# Altium project PCB_Project_Main.PrjPcb
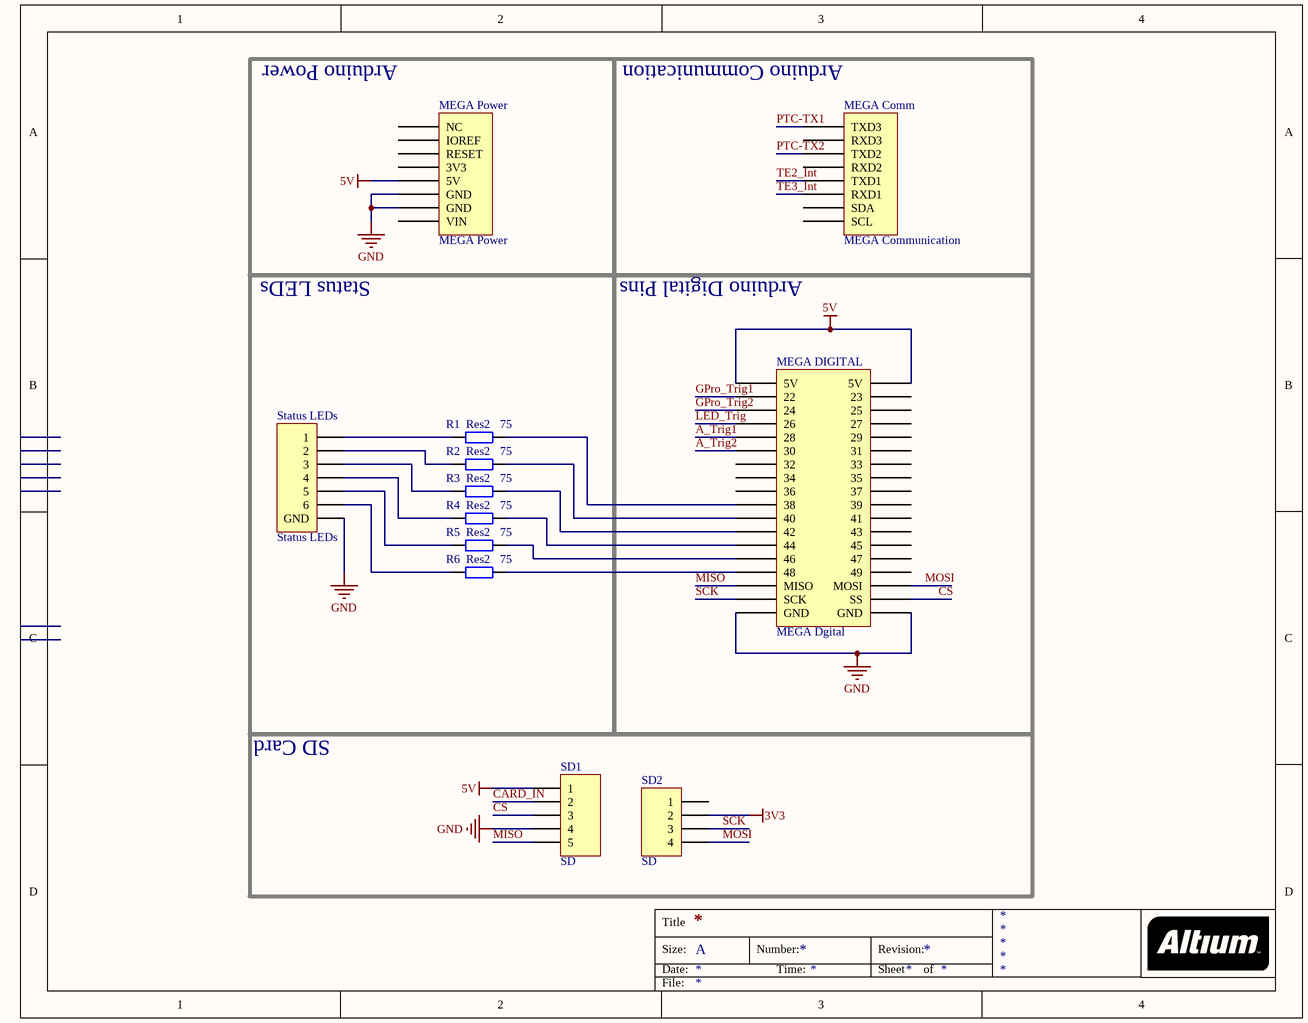
[diagram p0: ArduinoPWR-COMM-DIG_SDCard.SchDoc]
5 sheets, 49 parts. Net scope: global (net labels, ports and power ports of the same name join across sheets).
Board file: ArduinoMainBoard.PcbDoc
Sheets:
  ArduinoPWR-COMM-DIG_SDCard.SchDoc
  Analog_Input.SchDoc
  Telemetry_AnalogSensors_PTC08_Shifter.SchDoc
  Power_TimerEvents.SchDoc
  GoPro_Actuator_LED.SchDoc

## Sheet ArduinoPWR-COMM-DIG_SDCard.SchDoc
size A

### Parts
MEGA_Comm  MEGA Communication  [HDR1X8]
MEGA_DIGITAL  MEGA Dgital  [HDR2X18]
MEGA_Power  MEGA Power  [HDR1X8]
R1  Res2  value 75  [AXIAL-0.4]
R2  Res2  value 75  [AXIAL-0.4]
R3  Res2  value 75  [AXIAL-0.4]
R4  Res2  value 75  [AXIAL-0.4]
R5  Res2  value 75  [AXIAL-0.4]
R6  Res2  value 75  [AXIAL-0.4]
SD1  SD  [HDR1X5]
SD2  SD  [HDR1X4]
Status_LEDs  Status LEDs  [HDR1X7]

### Blocks framed on the sheet
Status LEDs: R1-R6 Status_LEDs
Arduino Digital Pins: MEGA_DIGITAL
SD Card: SD1 SD2

### Nets
3V3: SD2.2
5V: MEGA_DIGITAL.1(5V) MEGA_DIGITAL.2(5V) MEGA_Power.5(5V) SD1.1
GND: MEGA_DIGITAL.35(GND) MEGA_DIGITAL.36(GND) MEGA_Power.6(GND) MEGA_Power.7(GND) SD1.4 Status_LEDs.7(GND)
A_Trig1: MEGA_DIGITAL.9(28)
A_Trig2: MEGA_DIGITAL.11(30)
CARD_IN: SD1.2
CS: MEGA_DIGITAL.34(SS) SD1.3
GPro_Trig1: MEGA_DIGITAL.5(22)
GPro_Trig2: MEGA_DIGITAL.25(24)
LED_Trig: MEGA_DIGITAL.7(26)
MISO: MEGA_DIGITAL.31(MISO) SD1.5
MOSI: MEGA_DIGITAL.32(MOSI) SD2.4
PTC-TX1: MEGA_Comm.1(TXD3)
PTC-TX2: MEGA_Comm.3(TXD2)
SCK: MEGA_DIGITAL.33(SCK) SD2.3
TE2_Int: MEGA_Comm.5(TXD1)
TE3_Int: MEGA_Comm.6(RXD1)
NetMEGA_DIGITAL_3: MEGA_DIGITAL.3(44) R4.1
NetMEGA_DIGITAL_19: MEGA_DIGITAL.19(38) R1.1
NetMEGA_DIGITAL_21: MEGA_DIGITAL.21(40) R2.1
NetMEGA_DIGITAL_23: MEGA_DIGITAL.23(42) R3.1
NetMEGA_DIGITAL_27: MEGA_DIGITAL.27(46) R5.1
NetMEGA_DIGITAL_29: MEGA_DIGITAL.29(48) R6.1
NetR1_2: R1.2 Status_LEDs.1
NetR2_2: R2.2 Status_LEDs.2
NetR3_2: R3.2 Status_LEDs.3
NetR4_2: R4.2 Status_LEDs.4
NetR5_2: R5.2 Status_LEDs.5
NetR6_2: R6.2 Status_LEDs.6

Not connected (* = marked no-connect by the designer): MEGA_Comm 2(RXD3) 4(RXD2) 7(SDA) 8(SCL); MEGA_DIGITAL 4(23) 6(25) 8(27) 10(29) 12(31) 13(32) 14(33) 15(34) 16(35) 17(36) 18(37) 20(39) 22(41) 24(43) 26(45) 28(47) 30(49); MEGA_Power 1(NC) 2(IOREF) 3(RESET) 4(3V3) 8(VIN); SD2 1

### Notes on the sheet
- Arduino Power
- (near MEGA_Comm) Arduino Communication
- Title
- Size:
- Date:
- A
- Number:
- Time:
- Revision:
- Sheet
- of
- File:

### Library data of the parts
MEGA_Comm MEGA_DIGITAL MEGA_Power = Component_1
R1-R6 = Res2: Resistor; Published: 8-Jun-2000; LatestRevisionDate: 17-Jul-2002; LatestRevisionNote: Re-released for DXP Platform.; PackageReference: AXIAL-0.4; Publisher: Altium Limited; PackageDescription: Axial Device, Thru-Hole; 2 Leads; 0.4 in Pin Spacing
SD1 = Header 5: Header, 5-Pin; LatestRevisionDate: 17-Jul-2002; LatestRevisionNote: Re-released for DXP Platform.; Publisher: Altium Limited
SD2 = Header 4: Header, 4-Pin; LatestRevisionDate: 17-Jul-2002; LatestRevisionNote: Re-released for DXP Platform.; Publisher: Altium Limited
Status_LEDs = Header 7: Header, 7-Pin; LatestRevisionDate: 17-Jul-2002; LatestRevisionNote: Re-released for DXP Platform.; Publisher: Altium Limited

## Sheet Analog_Input.SchDoc
size A
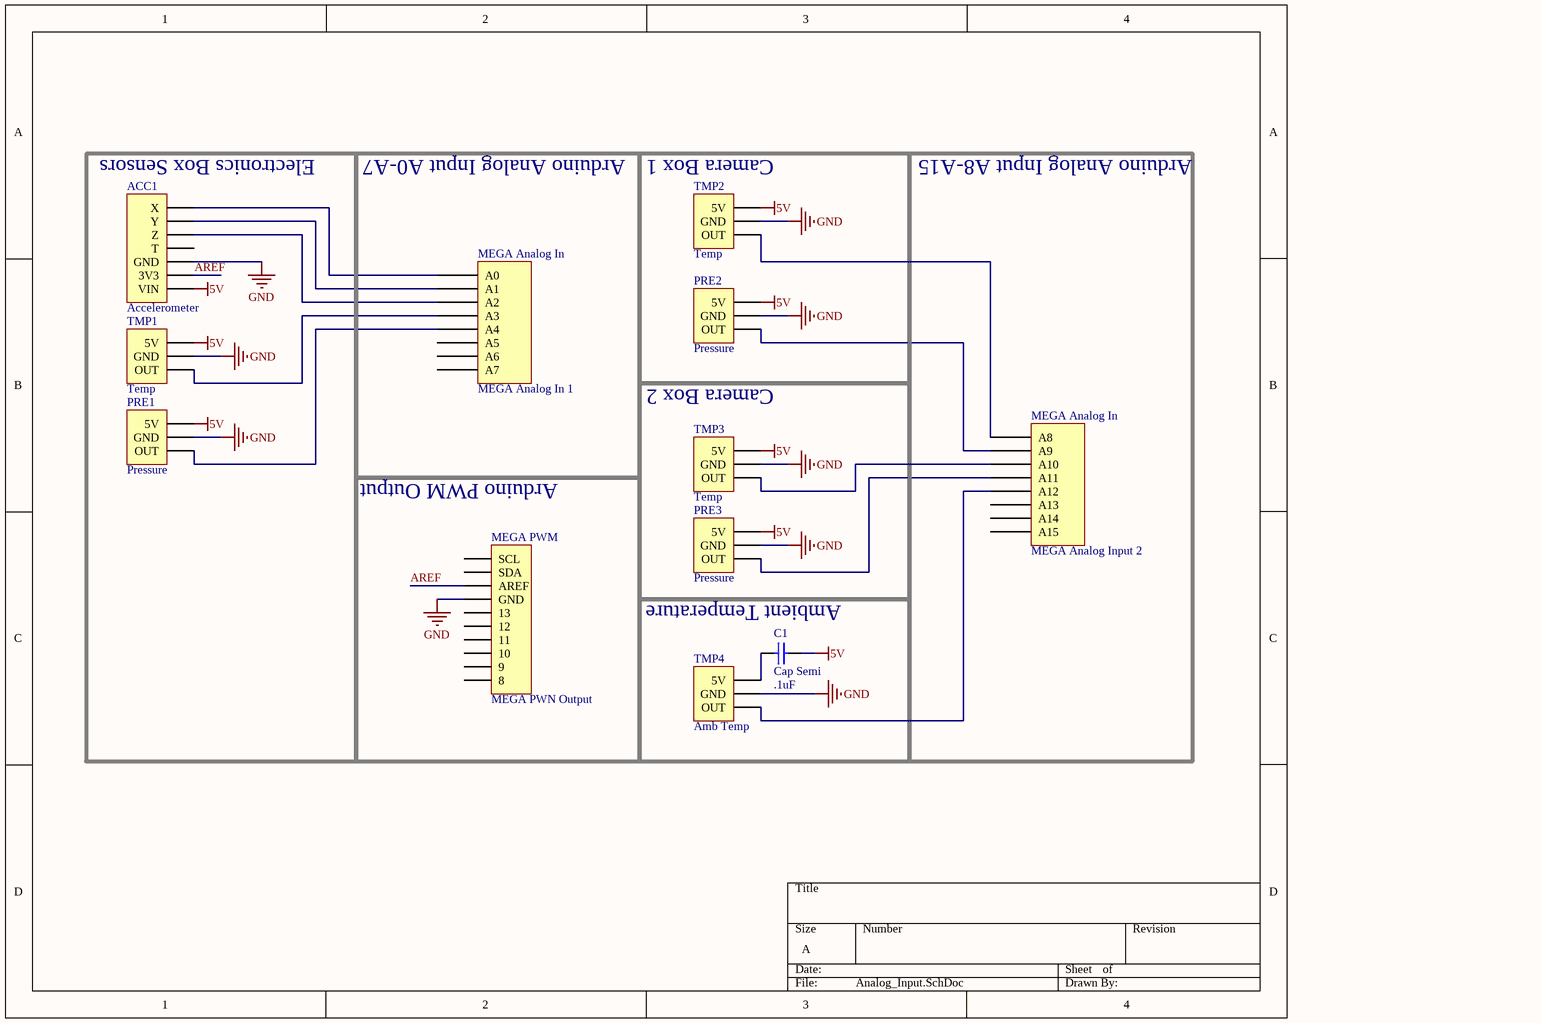
[diagram p1: Analog_Input.SchDoc]

### Parts
(Parts that share a designator on the sheet are numbered #1, #2 ... from top to bottom, then left to right.)
ACC1  Accelerometer  [HDR1X7]
C1  Cap Semi  value .1uF  [0402]
MEGA_Analog_In#1  MEGA Analog In 1  [HDR1X8]
MEGA_Analog_In#2  MEGA Analog Input 2  [HDR1X8]
MEGA_PWM  MEGA PWN Output  [HDR1X10]
PRE1  Pressure  [HDR1X3]
PRE2  Pressure  [HDR1X3]
PRE3  Pressure  [HDR1X3]
TMP1  Temp  [HDR1X3]
TMP2  Temp  [HDR1X3]
TMP3  Temp  [HDR1X3]
TMP4  Amb Temp  [HDR1X3]

### Blocks framed on the sheet
Electronics Box Sensors: ACC1 PRE1 TMP1
Arduino Analog Input A0-A7: MEGA_Analog_In#1
Camera Box 1: PRE2 TMP2
Arduino Analog Input A8-A15: MEGA_Analog_In#2
Camera Box 2: PRE3 TMP3
Arduino PWM Output: MEGA_PWM
Ambient Temperature: C1 TMP4

### Nets
5V: ACC1.1(VIN) C1.1 PRE1.1(5V) PRE2.1(5V) PRE3.1(5V) TMP1.1(5V) TMP2.1(5V) TMP3.1(5V)
GND: ACC1.3(GND) MEGA_PWM.4(GND) PRE1.2(GND) PRE2.2(GND) PRE3.2(GND) TMP1.2(GND) TMP2.2(GND) TMP3.2(GND) TMP4.2(GND)
AREF: ACC1.2(3V3) MEGA_PWM.3(AREF)
NetACC1_5: ACC1.5(Z) MEGA_Analog_In#1.3(A2)
NetACC1_6: ACC1.6(Y) MEGA_Analog_In#1.2(A1)
NetACC1_7: ACC1.7(X) MEGA_Analog_In#1.1(A0)
NetC1_2: C1.2 TMP4.1(5V)
NetMEGA_Analog_In#1_4: MEGA_Analog_In#1.4(A3) TMP1.3(OUT)
NetMEGA_Analog_In#1_5: MEGA_Analog_In#1.5(A4) PRE1.3(OUT)
NetMEGA_Analog_In#2_1: MEGA_Analog_In#2.1(A8) TMP2.3(OUT)
NetMEGA_Analog_In#2_2: MEGA_Analog_In#2.2(A9) PRE2.3(OUT)
NetMEGA_Analog_In#2_3: MEGA_Analog_In#2.3(A10) TMP3.3(OUT)
NetMEGA_Analog_In#2_4: MEGA_Analog_In#2.4(A11) PRE3.3(OUT)
NetMEGA_Analog_In#2_5: MEGA_Analog_In#2.5(A12) TMP4.3(OUT)

Not connected (* = marked no-connect by the designer): ACC1 4(T); MEGA_Analog_In#1 6(A5) 7(A6) 8(A7); MEGA_Analog_In#2 6(A13) 7(A14) 8(A15); MEGA_PWM 1(SCL) 2(SDA) 5(13) 6(12) 7(11) 8(10) 9 10(8)

### Library data of the parts
ACC1 = Header 7: Header, 7-Pin; LatestRevisionDate: 17-Jul-2002; LatestRevisionNote: Re-released for DXP Platform.; Publisher: Altium Limited
C1 = Cap Semi: Capacitor (Semiconductor SIM Model); Published: 8-Jun-2000; LatestRevisionDate: 29-May-2009; LatestRevisionNote: IPC-7351 Footprint Added.; PackageReference: C1206; Publisher: Altium Limited; PackageDescription: Chip Capacitor
MEGA_Analog_In#1 MEGA_Analog_In#2 = Component_1
MEGA_PWM = Header 10: Header, 10-Pin; LatestRevisionDate: 17-Jul-2002; LatestRevisionNote: Re-released for DXP Platform.; Publisher: Altium Limited
PRE1-PRE3 TMP1-TMP4 = Header 3: Header, 3-Pin; LatestRevisionDate: 17-Jul-2002; LatestRevisionNote: Re-released for DXP Platform.; Publisher: Altium Limited

## Sheet Telemetry_AnalogSensors_PTC08_Shifter.SchDoc
size A
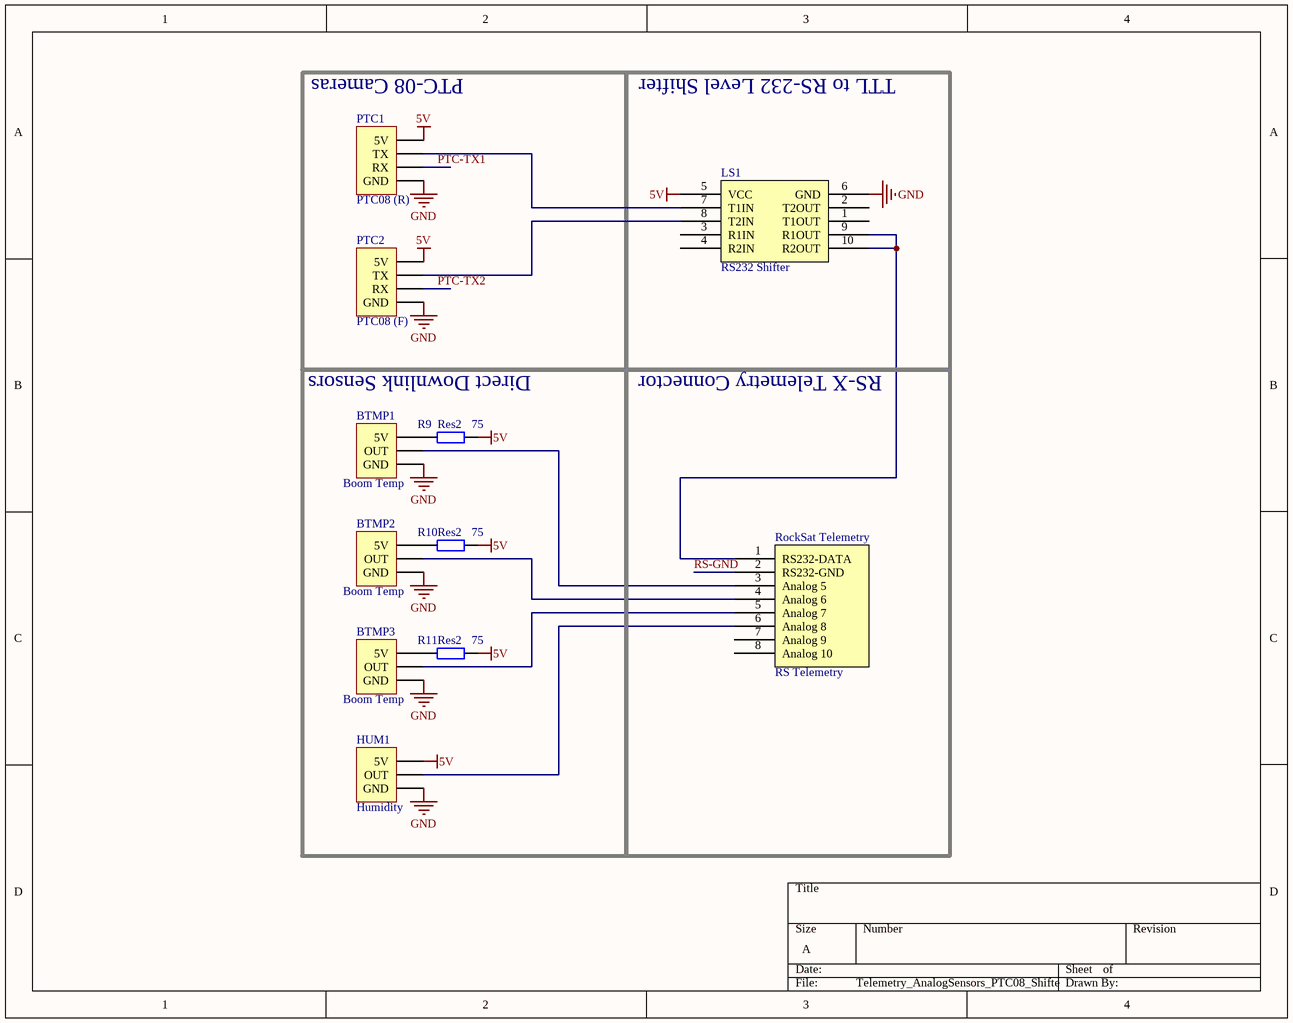
[diagram p2: Telemetry_AnalogSensors_PTC08_Shifter.SchDoc]

### Parts
BTMP1  Boom Temp  [HDR1X3]
BTMP2  Boom Temp  [HDR1X3]
BTMP3  Boom Temp  [HDR1X3]
HUM1  Humidity  [HDR1X3]
LS1  RS232 Shifter
PTC1  PTC08 (R)  [HDR1X4]
PTC2  PTC08 (F)  [HDR1X4]
R9  Res2  value 75  [AXIAL-0.4]
R10  Res2  value 75  [AXIAL-0.4]
R11  Res2  value 75  [AXIAL-0.4]
RockSat_Telemetry  RS Telemetry

### Blocks framed on the sheet
Direct Downlink Sensors: BTMP1-BTMP3 HUM1 R9-R11
RS-X Telemetry Connector: RockSat_Telemetry

### Nets
5V: HUM1.1(5V) LS1.5(VCC) PTC1.1(5V) PTC2.1(5V) R9.1 R10.1 R11.1
GND: BTMP1.3(GND) BTMP2.3(GND) BTMP3.3(GND) HUM1.3(GND) LS1.6(GND) PTC1.4(GND) PTC2.4(GND)
PTC-TX1: PTC1.3(RX)
PTC-TX2: PTC2.3(RX)
RS-GND: RockSat_Telemetry.2(RS232-GND)
NetBTMP1_1: BTMP1.1(5V) R9.2
NetBTMP1_2: BTMP1.2(OUT) RockSat_Telemetry.3(Analog_5)
NetBTMP2_1: BTMP2.1(5V) R10.2
NetBTMP2_2: BTMP2.2(OUT) RockSat_Telemetry.4(Analog_6)
NetBTMP3_1: BTMP3.1(5V) R11.2
NetBTMP3_2: BTMP3.2(OUT) RockSat_Telemetry.5(Analog_7)
NetHUM1_2: HUM1.2(OUT) RockSat_Telemetry.6(Analog_8)
NetLS1_7: LS1.7(T1IN) PTC1.2(TX)
NetLS1_8: LS1.8(T2IN) PTC2.2(TX)
NetLS1_9: LS1.9(R1OUT) LS1.10(R2OUT) RockSat_Telemetry.1(RS232-DATA)

Not connected (* = marked no-connect by the designer): LS1 1(T1OUT) 2(T2OUT) 3(R1IN) 4(R2IN); RockSat_Telemetry 7(Analog_9) 8(Analog_10)

### Notes on the sheet
- (near PTC1) PTC-08 Cameras
- TTL to RS-232 Level Shifter

### Library data of the parts
BTMP1-BTMP3 HUM1 = Header 3: Header, 3-Pin; LatestRevisionDate: 17-Jul-2002; LatestRevisionNote: Re-released for DXP Platform.; Publisher: Altium Limited
LS1 RockSat_Telemetry = Component_1
PTC1 PTC2 = Header 4: Header, 4-Pin; LatestRevisionDate: 17-Jul-2002; LatestRevisionNote: Re-released for DXP Platform.; Publisher: Altium Limited
R9-R11 = Res2: Resistor; Published: 8-Jun-2000; LatestRevisionDate: 17-Jul-2002; LatestRevisionNote: Re-released for DXP Platform.; PackageReference: AXIAL-0.4; Publisher: Altium Limited; PackageDescription: Axial Device, Thru-Hole; 2 Leads; 0.4 in Pin Spacing

## Sheet Power_TimerEvents.SchDoc
size A
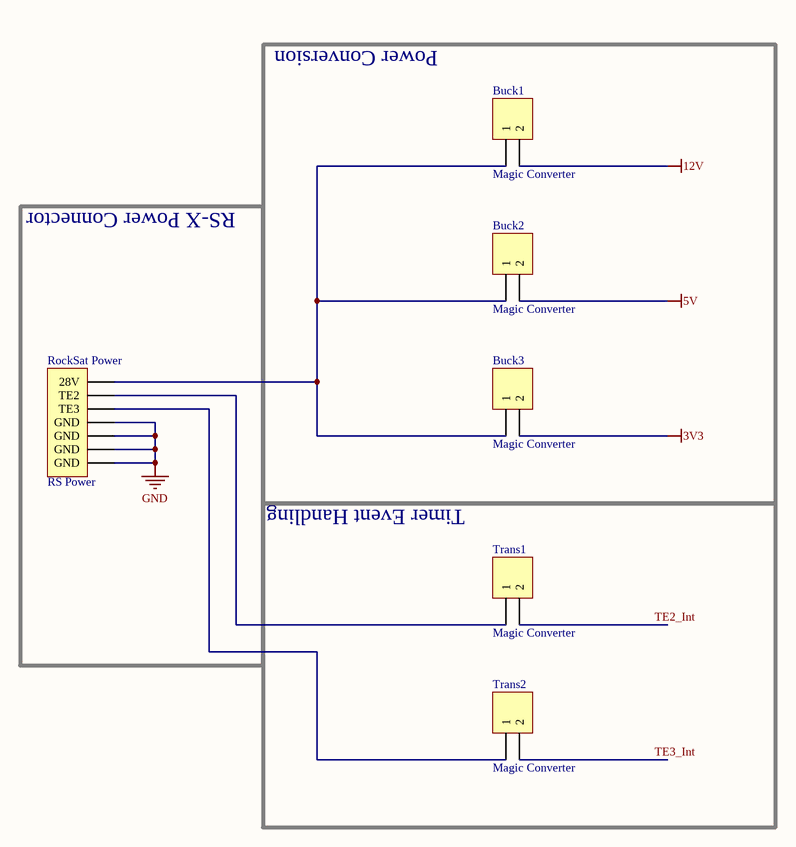
[diagram p3: Power_TimerEvents.SchDoc]

### Parts
Buck1  Magic Converter  [HDR1X2]
Buck2  Magic Converter  [HDR1X2]
Buck3  Magic Converter  [HDR1X2]
RockSat_Power  RS Power  [HDR1X7]
Trans1  Magic Converter  [HDR1X2]
Trans2  Magic Converter  [HDR1X2]

### Blocks framed on the sheet
Power Conversion: Buck1-Buck3
RS-X Power Connector: RockSat_Power
Timer Event Handling: Trans1 Trans2

### Nets
3V3: Buck3.2
5V: Buck2.2
12V: Buck1.2
GND: RockSat_Power.4(GND) RockSat_Power.5(GND) RockSat_Power.6(GND) RockSat_Power.7(GND)
TE2_Int: Trans1.2
TE3_Int: Trans2.2
NetBuck1_1: Buck1.1 Buck2.1 Buck3.1 RockSat_Power.1(28V)
NetRockSat_Power_2: RockSat_Power.2(TE2) Trans1.1
NetRockSat_Power_3: RockSat_Power.3(TE3) Trans2.1

### Library data of the parts
Buck1-Buck3 Trans1 Trans2 = Header 2: Header, 2-Pin; LatestRevisionDate: 17-Jul-2002; LatestRevisionNote: Re-released for DXP Platform.; Publisher: Altium Limited
RockSat_Power = Header 7: Header, 7-Pin; LatestRevisionDate: 17-Jul-2002; LatestRevisionNote: Re-released for DXP Platform.; Publisher: Altium Limited

## Sheet GoPro_Actuator_LED.SchDoc
size A
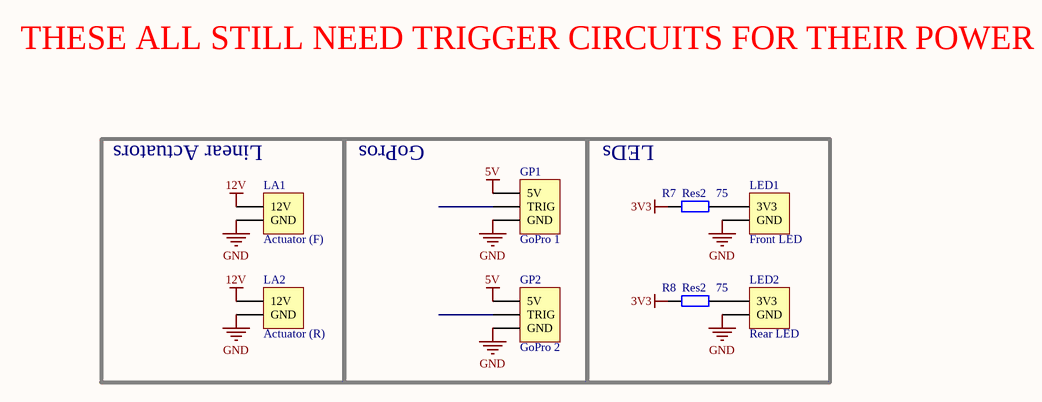
[diagram p4: GoPro_Actuator_LED.SchDoc]

### Parts
GP1  GoPro 1  [HDR1X3]
GP2  GoPro 2  [HDR1X3]
LA1  Actuator (F)  [HDR1X2]
LA2  Actuator (R)  [HDR1X2]
LED1  Front LED  [HDR1X2]
LED2  Rear LED  [HDR1X2]
R7  Res2  value 75  [AXIAL-0.4]
R8  Res2  value 75  [AXIAL-0.4]

### Blocks framed on the sheet
Linear Actuators: LA1 LA2
GoPros: GP1 GP2
LEDs: LED1 LED2 R7 R8

### Nets
3V3: R7.2 R8.2
5V: GP1.1(5V) GP2.1(5V)
12V: LA1.1(12V) LA2.1(12V)
GND: GP1.3(GND) GP2.3(GND) LA1.2(GND) LA2.2(GND) LED1.2(GND) LED2.2(GND)
NetLED1_1: LED1.1(3V3) R7.1
NetLED2_1: LED2.1(3V3) R8.1

Not connected (* = marked no-connect by the designer): GP1 2(TRIG); GP2 2(TRIG)

### Notes on the sheet
- THESE ALL STILL NEED TRIGGER CIRCUITS FOR THEIR POWER

### Library data of the parts
GP1 GP2 = Header 3: Header, 3-Pin; LatestRevisionDate: 17-Jul-2002; LatestRevisionNote: Re-released for DXP Platform.; Publisher: Altium Limited
LA1 LA2 LED1 LED2 = Header 2: Header, 2-Pin; LatestRevisionDate: 17-Jul-2002; LatestRevisionNote: Re-released for DXP Platform.; Publisher: Altium Limited
R7 R8 = Res2: Resistor; Published: 8-Jun-2000; LatestRevisionDate: 17-Jul-2002; LatestRevisionNote: Re-released for DXP Platform.; PackageReference: AXIAL-0.4; Publisher: Altium Limited; PackageDescription: Axial Device, Thru-Hole; 2 Leads; 0.4 in Pin Spacing

## Nets that join several sheets
3V3: ArduinoPWR-COMM-DIG_SDCard (SD2.2), Power_TimerEvents (Buck3.2), GoPro_Actuator_LED (R7.2 R8.2)
5V: ArduinoPWR-COMM-DIG_SDCard (MEGA_DIGITAL.1 MEGA_DIGITAL.2 MEGA_Power.5 SD1.1), Analog_Input (8 pins), Telemetry_AnalogSensors_PTC08_Shifter (7 pins), Power_TimerEvents (Buck2.2), GoPro_Actuator_LED (GP1.1 GP2.1)
12V: Power_TimerEvents (Buck1.2), GoPro_Actuator_LED (LA1.1 LA2.1)
GND: ArduinoPWR-COMM-DIG_SDCard (6 pins), Analog_Input (9 pins), Telemetry_AnalogSensors_PTC08_Shifter (7 pins), Power_TimerEvents (RockSat_Power.4 RockSat_Power.5 RockSat_Power.6 RockSat_Power.7), GoPro_Actuator_LED (6 pins)
PTC-TX1: ArduinoPWR-COMM-DIG_SDCard (MEGA_Comm.1), Telemetry_AnalogSensors_PTC08_Shifter (PTC1.3)
PTC-TX2: ArduinoPWR-COMM-DIG_SDCard (MEGA_Comm.3), Telemetry_AnalogSensors_PTC08_Shifter (PTC2.3)
TE2_Int: ArduinoPWR-COMM-DIG_SDCard (MEGA_Comm.5), Power_TimerEvents (Trans1.2)
TE3_Int: ArduinoPWR-COMM-DIG_SDCard (MEGA_Comm.6), Power_TimerEvents (Trans2.2)